# Altium schematic sheet DDR3.SchDoc
size A4; SheetNumber: 11; SheetTotal: 19
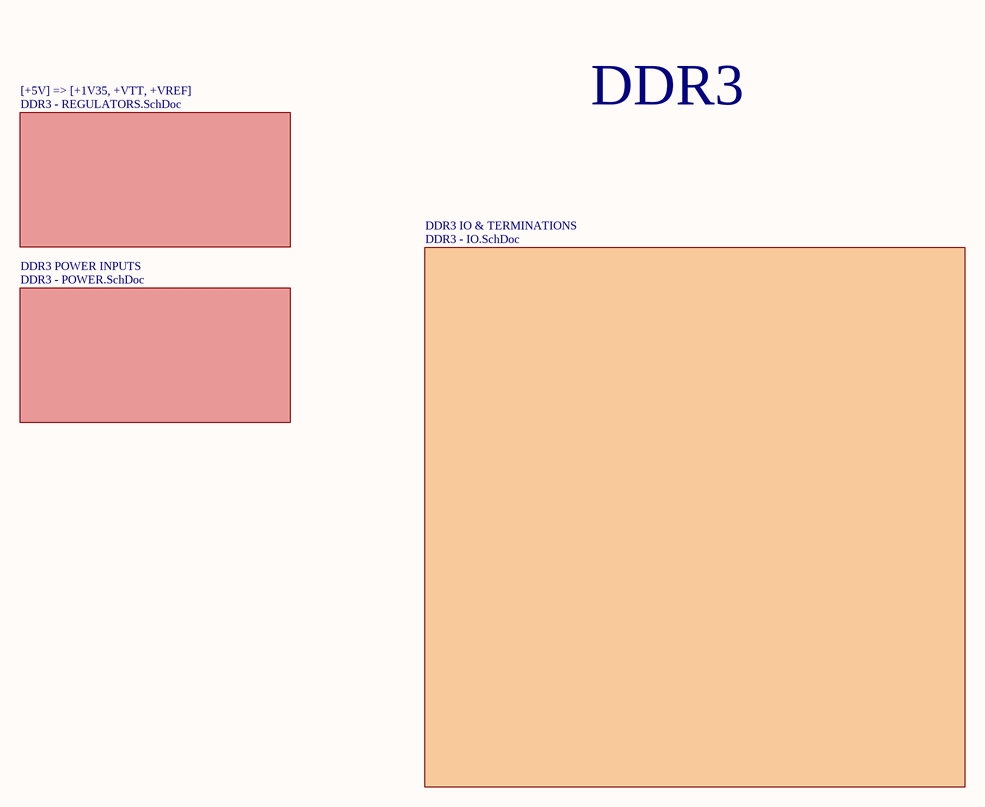
[diagram p0: DDR3.SchDoc]

## Sub-sheets
[+5V] => [+1V35, +VTT, +VREF] = DDR3 - REGULATORS.SchDoc: no entries
DDR3 IO & TERMINATIONS = DDR3 - IO.SchDoc: no entries
DDR3 POWER INPUTS = DDR3 - POWER.SchDoc: no entries

## Notes on the sheet
- DDR3